# EAGLE design usb-cable (EAGLE 9.1.1)
AUTHOR: Adam Hořčica; TITLE: USB Charger Board; VERSION: 1.0
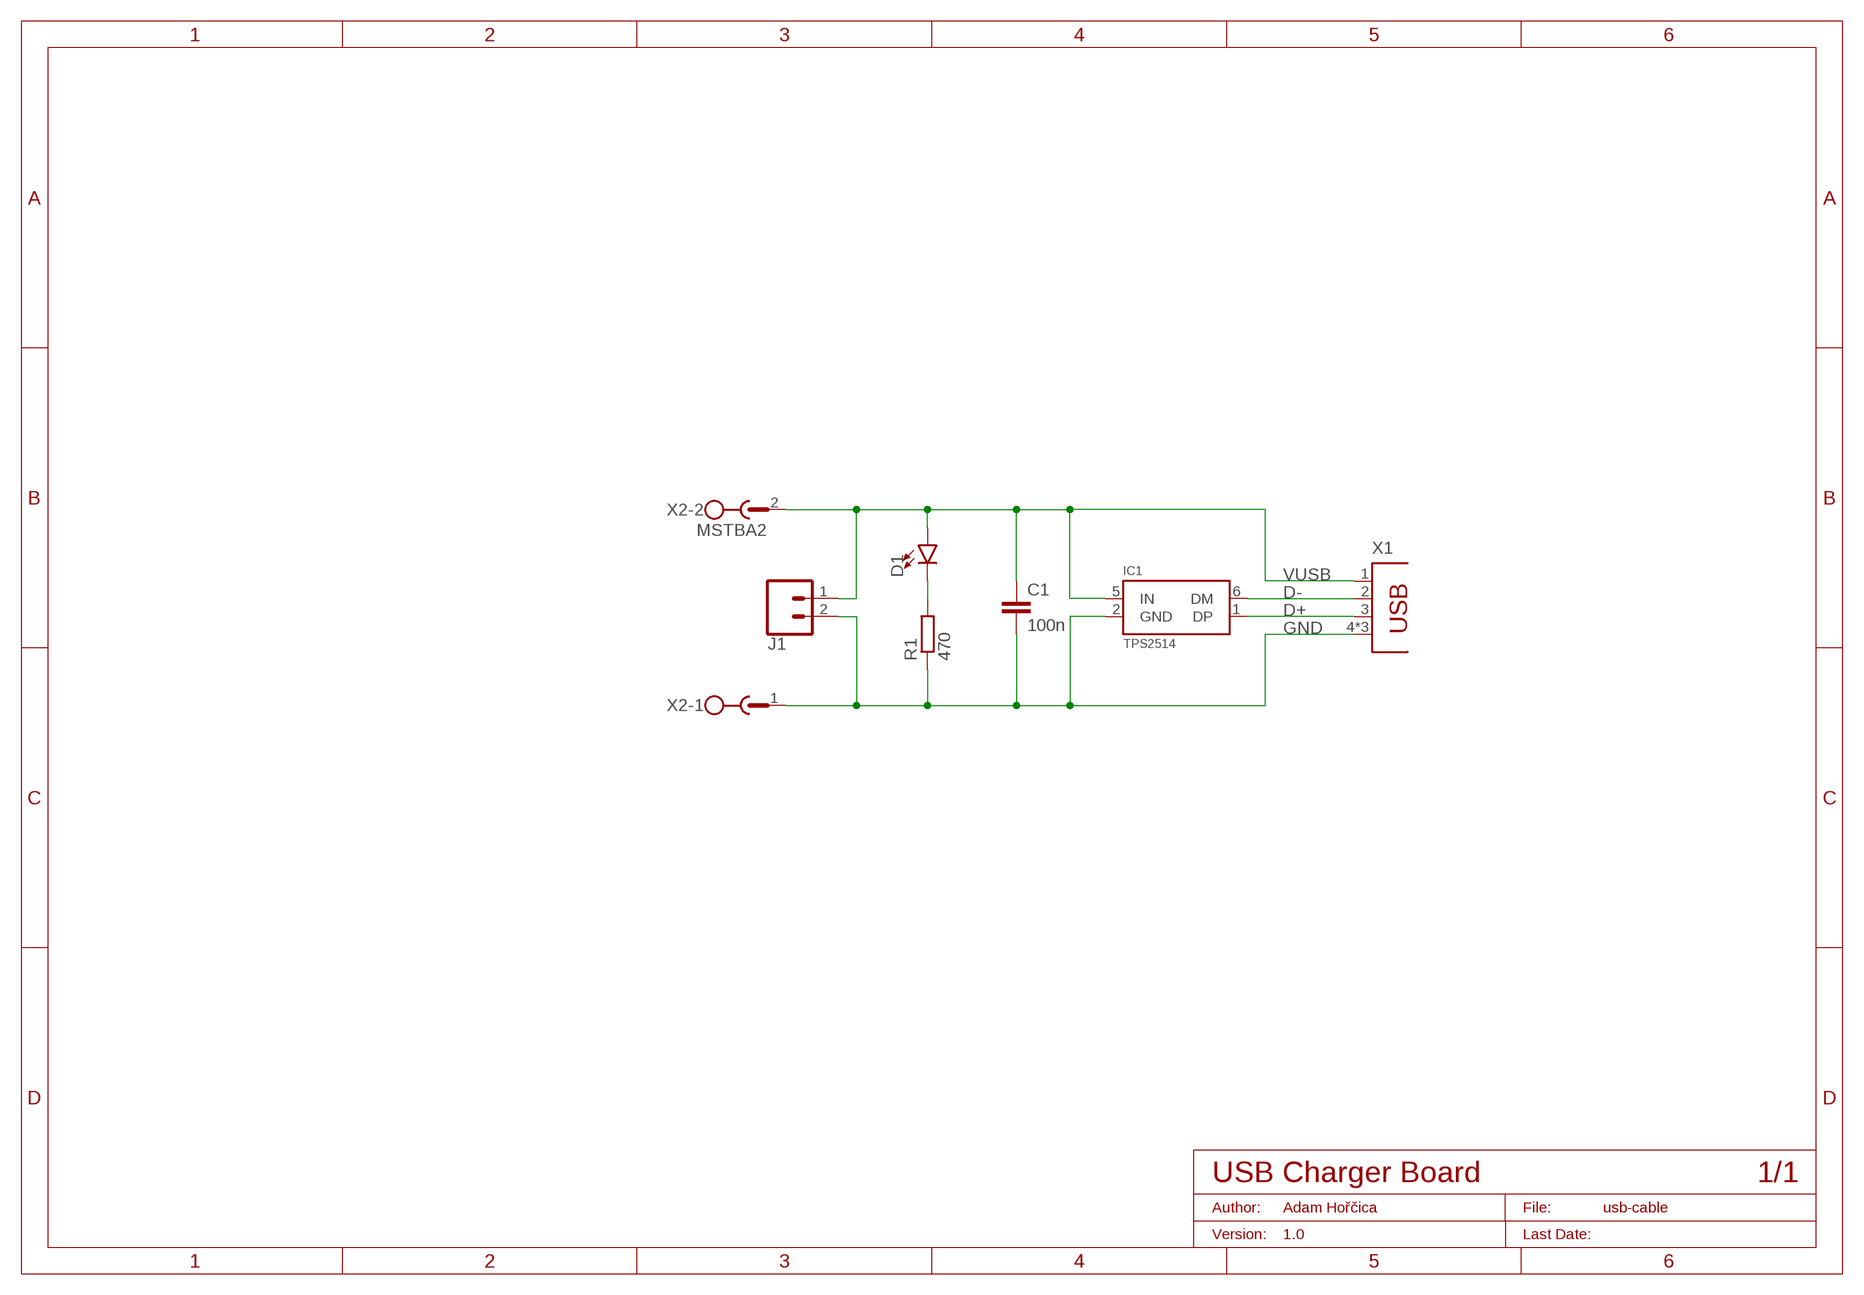
[diagram p0: schematic, sheet 1]

## Parts
C1  100n  C-EUC1206K  [C1206K]
D1  LED0805-RESISTOR-PACKAGE  [LED-0805]
IC1  TPS2514  [SOT23-6]
J1  CONN_02  [1X02]
R1  470  R-EU_R0805  [R0805]
X1  PN87520  [PN87520]
X2  MSTBA2  [MSTBA2]

## Nets
D+: IC1.1(DP) X1.3
D-: IC1.6(DM) X1.2
GND: C1.2 IC1.2(GND) J1.2 R1.1 X1.4 X1.S1 X1.S2 X2.1
N$3: D1.2(C) R1.2
VUSB: C1.1 D1.1(A) IC1.5(IN) J1.1 X1.1 X2.2

## Library data of the parts
C1 = rcl:C-EU: CAPACITOR, European symbol; SPICEPREFIX: C
D1 = led:LED
IC1 = ic-power:TPS2514
J1 = SparkFun-Connectors:CONN_02: Multi connection point. Often used as Generic Header-pin footprint for 0.1 inch spaced/style header connections On any of the 0.1 inch spaced packages, you can populate with these: Break Away Headers - Straight <https://www.sparkfun.com/products/116> (PRT-00116) Break Away Male Headers - Right Angle <https://www.sparkfun.com/products/553> (PRT-00553) Female Headers <https://www.sparkfun.com/products/115> (PRT-00115) Break Away Headers - Machine Pin <https://www.sparkfun.com/products/117> (PRT-00117) Break Away Female Headers - Swiss Machine Pin <https://www.sparkfun.com/products/743> (PRT-00743) For SCREWTERMINALS and SPRING TERMINALS visit here: Screw Terimnals on SparkFun.com <https://www.sparkfun.com/search/results?term=Screw+Terminals> (5mm/3.5mm/2.54mm spacing) This device is also useful as a general connection point to wire up your design to another part of your project. Our various solder wires solder well into these plated through hole pads. Hook-Up Wire - Assortment (Stranded, 22 AWG) <https://www.sparkfun.com/products/11375> (PRT-11375) Hook-Up Wire - Assortment (Solid Core, 22 AWG) <https://www.sparkfun.com/products/11367> (PRT-11367) View the entire wire category on our website here <https://www.sparkfun.com/categories/141> Special notes: Molex polarized connector foot print use with: PRT-08233 with associated crimp pins and housings. 2.54_SCREWTERM for use with PRT-10571. 3.5mm Screw Terminal footprints for PRT-08084 5mm Screw Terminal footprints for use with PRT-08432
R1 = rcl:R-EU_: RESISTOR, European symbol; SPICEPREFIX: R
X1 = connectors:PN87520: BERG USB connector; OC_FARNELL: unknown; OC_NEWARK: unknown
X2 = con-phoenix-508:MSTBA2: PHOENIX; MF: FARNELL; MPN: 1757242; OC_FARNELL: 3705171; OC_NEWARK: 71C4161

## Board
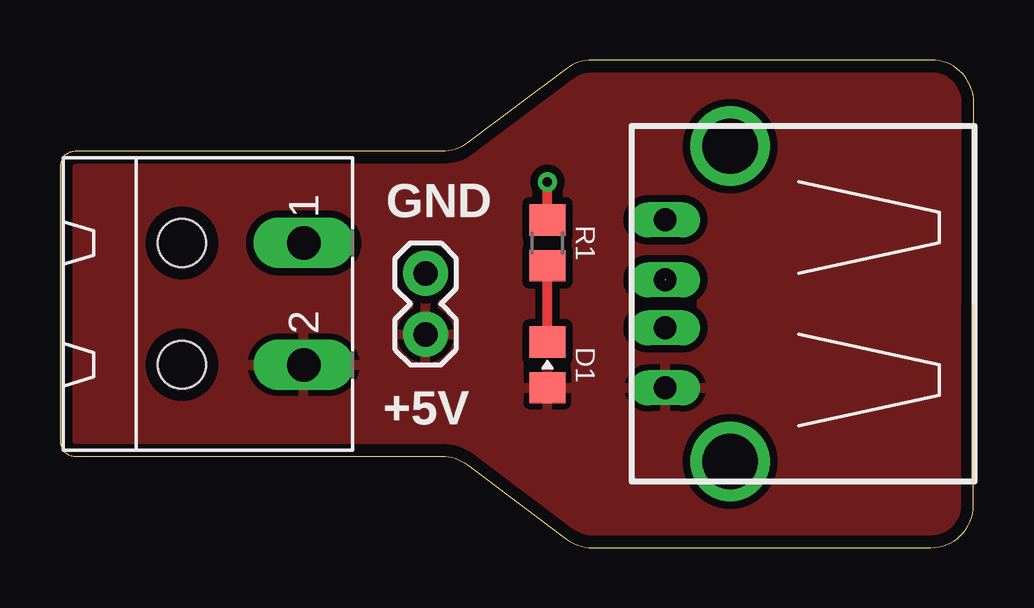
[diagram p1: board, top side]
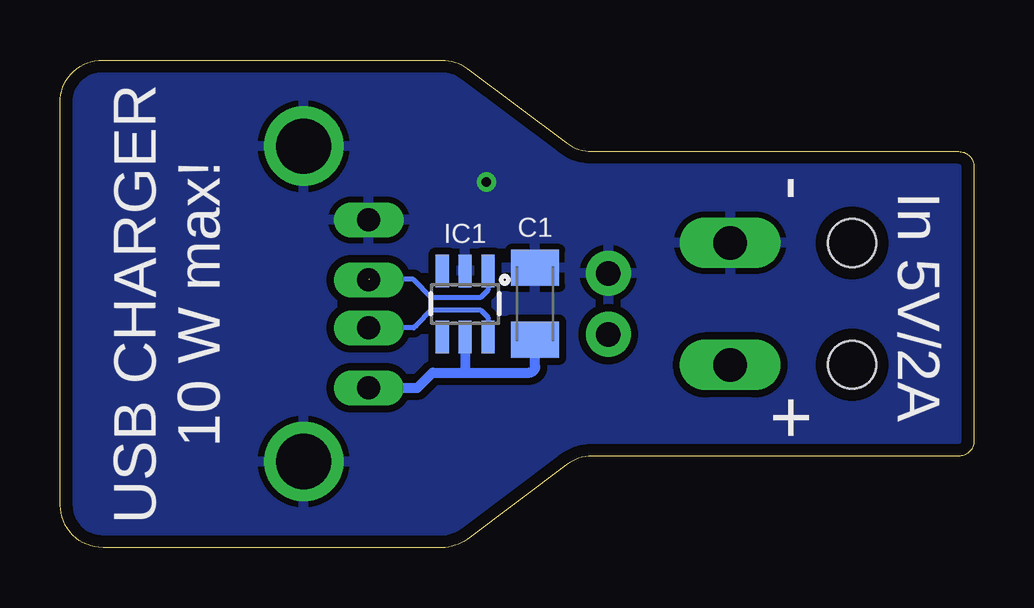
[diagram p2: board, bottom side, seen from below]

Size 38.1 x 20.32 mm. Coordinates in mm from the lower left corner, seen from the top.
Outline: 0,15.88 0,4.45 arc90 0.64,3.81 15.92,3.81 arc-37 16.98,3.45 21.12,0.36 arc37 22.18,0 36.3,0 arc90 38.08,1.77 38.1,18.54 arc90 36.32,20.32 22.18,20.32 arc37 21.12,19.96 16.98,16.87 arc-37 15.92,16.51 0.64,16.51 arc90 0,15.88
Copper layers (1*16): Top 0.035mm / dielectric 1.5mm / Bottom 0.035mm
Design rules "default *": minimum track width 8mil, minimum drill 0.35mm, track to track 12mil, track to pad 12mil, pad to pad 12mil, via to via 12mil, smd to smd 12mil, copper to edge 20mil, drill to drill 6mil, minimum pad ring 10mil, minimum via ring 8mil, stop-mask expansion 4mil, vias tented up to drill 0mil, thermal gap 10mil
Holes 2 mm at 5.08,12.7 5.08,7.62

### Footprints (pad centres in the part's own frame; a part is rotated, then mirrored left to right if it is on the bottom)
C1206K = smd 1.5 x 2: 1 -1.5,0; 2 1.5,0
LED-0805 = smd 1.3 x 1.5: 1 -0.95,0; 2 0.95,0
SOT23-6 = smd 0.55 x 1.35: 1 -0.95,-1.375; 2 0,-1.375; 3 0.95,-1.375; 4 0.95,1.375; 5 0,1.375; 6 -0.95,1.375
1X02 = drill 1.016 pad 1.88: 1 0,0; 2 2.54,0
R0805 = smd 1.3 x 1.5: 1 -0.95,0; 2 0.95,0
PN87520 = drill 0.95 long: 1 -3.5,2.71; 2 -1,2.71; 3 1,2.71; 4 3.5,2.71 | drill 2.3: S1 -6.57,0; S2 6.57,0
MSTBA2 = drill 1.397 long: 1 -2.54,5.08; 2 2.54,5.08

### Placement (x,y rotation side)
C1  18.29,10.16 90 bottom
D1  20.32,7.62 90 top
IC1  21.21,10.16 180 bottom
J1  15.24,8.89 90 top
R1  20.32,12.7 270 top
X1  27.94,10.16 90 top
X2  5.08,10.16 270 top

### Tracks (layer width: path | path; a pad name or v marks a point on that pad's centre or on a via)
D+  (1 unrouted)
  Bottom 0.203: IC1.1 20.26,10.73 20.57,10.41 22.61,10.41 23.37,11.18 25.21,11.18
D-
  Bottom 0.203: 23.35,9.16 23.24,9.27 | 23.24,9.27 22.61,9.91 20.57,9.91 20.26,9.59 IC1.6 | 23.24,9.27 23.35,9.16 | 23.35,9.16 X1.2
GND  (via drill 0.4)
  Top 0.406: R1.1 v20.32,15.24
  pour Bottom: -2.54,22.86 39.37,22.86 39.37,-2.54 -2.54,-2.54
N$3
  Top 0.406: D1.2 R1.2
VUSB
  Bottom 0.406: 21.21,7.29 22.56,7.29 23.2,6.66 X1.1 | 21.21,7.29 18.54,7.29 arc-90 18.29,7.55 C1.1 | IC1.5 21.21,7.29
  pour Top: -3.81,21.59 40.64,21.59 40.64,-1.27 -3.81,-1.27

### Text on the board
tPlace: GND | +5V
bPlace: - | In 5V/2A | USB CHARGER / 10 W max! | +